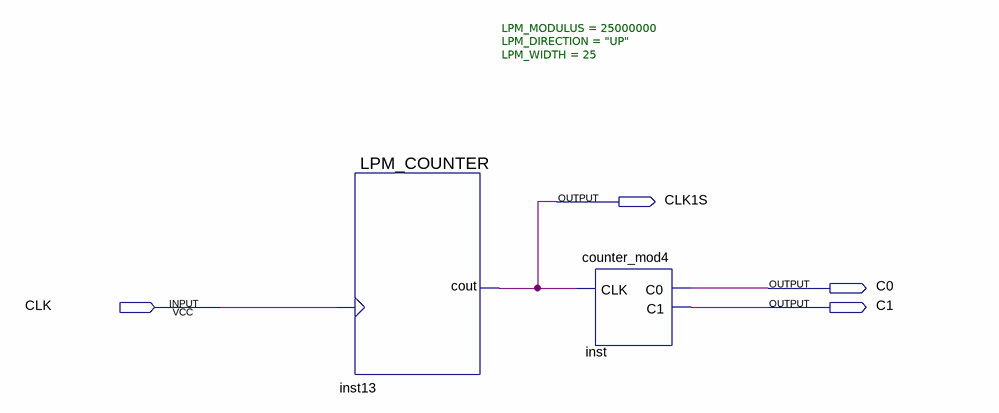
[diagram p0: schematic sheet]
// Quartus schematic Counter_mod4_1s.bdf as structural Verilog: 2 symbols, 4 pins
module Counter_mod4_1s (
  input  CLK,
  output CLK1S,
  output C0,
  output C1
);

  LPM_COUNTER #(.LPM_MODULUS(25000000), .LPM_DIRECTION("UP"), .LPM_WIDTH(25)) inst13 (.clock(CLK), .cout(CLK1S));
  counter_mod4 inst (.CLK(CLK1S), .C0(C0), .C1(C1));
endmodule
